# Altium schematic sheet Output Stages.SchDoc
size A3; SheetNumber: 4; SheetTotal: 5
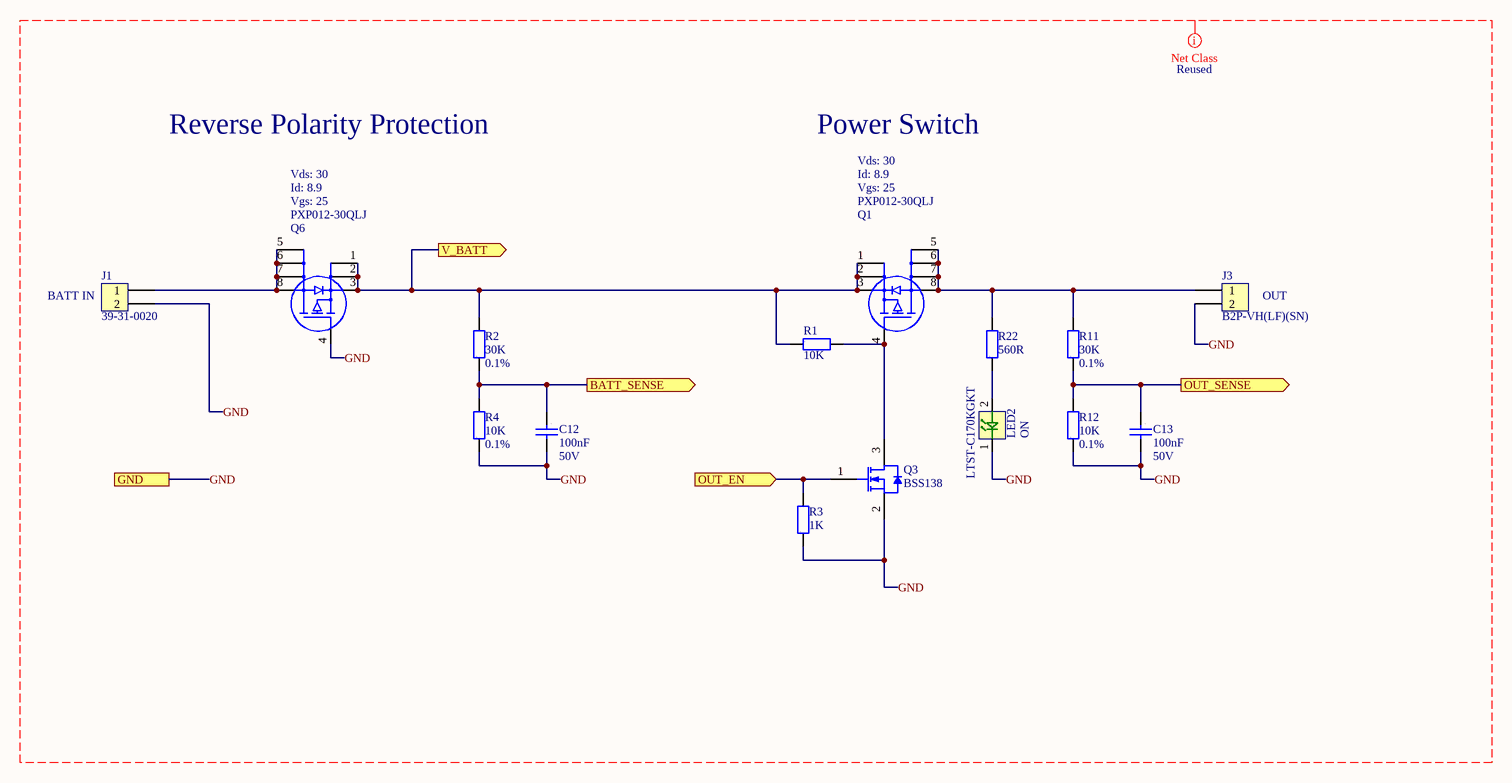
[diagram p0: Output Stages.SchDoc]

## Parts
C12  value 100nF  Voltage: 50V  [CAPC1608X08L]  (hidden comment: *)
C13  value 100nF  Voltage: 50V  [CAPC1608X08L]  (hidden comment: *)
J1  BATT IN  [39-31-0020]
J3  OUT  ManuPartNo: B2P-VH(LF)(SN)  [B2P-VH]
LED2  ON  ManuPartNo: LTST-C170KGKT  [CAPCP2012X11N]
Q1  Power Switch  ManuPartNo: PXP012-30QLJ  Vds: 30  Id: 8.9  Vgs: 25  [MLPAK33_SOT8002-1_NEX-M]
Q3  BSS138  [FAIR-SOT23-3_V]
Q6  Reverse Polarity Protection  ManuPartNo: PXP012-30QLJ  Vds: 30  Id: 8.9  Vgs: 25  [MLPAK33_SOT8002-1_NEX-M]
R1  value 10K  [RESC1608X06L]  (hidden comment: RESISTOR)
R2  value 30K  Tolerance: 0.1%  [RESC1608X06L]  (hidden comment: *)
R3  value 1K  [RESC1608X06L]  (hidden comment: RESISTOR)
R4  value 10K  Tolerance: 0.1%  [RESC1608X06L]  (hidden comment: *)
R11  value 30K  Tolerance: 0.1%  [RESC1608X06L]  (hidden comment: *)
R12  value 10K  Tolerance: 0.1%  [RESC1608X06L]  (hidden comment: *)
R22  value 560R  [RESC1608X06L]  (hidden comment: *)

## Ports
BATT_SENSE (out), GND, OUT_EN (in), OUT_SENSE (out), V_BATT (out)

## Nets
BATT_SENSE: C12.1 R2.1 R4.2 ; port BATT_SENSE
GND: C12.2 C13.2 J1.2 J3.2 LED2.1 Q3.2(S) Q6.4(Gate) R3.1 R4.1 R12.1 ; port GND
OUT_EN: Q3.1(G) R3.2 ; port OUT_EN
OUT_SENSE: C13.1 R11.1 R12.2 ; port OUT_SENSE
V_BATT: Q1.1(Source) Q1.2(Source) Q1.3(Source) Q6.1(Source) Q6.2(Source) Q6.3(Source) R1.1 R2.2 ; port V_BATT
NetJ1_1: J1.1 Q6.5(Drain) Q6.6(Drain) Q6.7(Drain) Q6.8(Drain)
NetJ3_1: J3.1 Q1.5(Drain) Q1.6(Drain) Q1.7(Drain) Q1.8(Drain) R11.2 R22.2
NetLED2_2: LED2.2 R22.1
NetQ1_4: Q1.4(Gate) Q3.3(D) R1.2

## Layout directives
net class Reused: GND

## Notes on the sheet
- ©
- CAD:
- Altium Designer
- Changed by:
- Drawing No:
- Change date:
- Title:
- Sub-Title:
- Project Sunride
  The Diamond
  32 Leavygreave Rd
  Broomhall, Sheffield
  United Kingdom
  S3 7RD
- THIS DRAWING REMAINS THE PROPERTY OF PROJECT SUNRIDE.
  COPYRIGHT FOR ALL PURPOSES IS VESTED IN PROJECT SUNRIDE.
  THE REPRODUCTION OF THIS DRAWING IN WHOLE OR IN PART IS PROHIBITED WITHOUT EXPRESS CONSENT IN WRITING. THIS DESIGN IS OFFERED FOR USE ONLY WITH EQUIPMENT MANUFACTURED OR SPECIFICALLY RECOMMENDED BY PROJECT SUNRIDE. RIGHTS ARE RESERVED TO MAKE A CHARGE FOR THE USE OF THIS DESIGN OR ANY PART THEREOF AND SUCH RIGHT SHALL SUBSIST UNLESS AND UNTIL THE SAME SHALL BE EXPRESSLY WAIVED IN WRITING. ACCEPTANCE OF THIS DRAWING WILL BE CONSTRUED AS AN ACCEPTANCE OF THESE CONDITIONS.
- Size:
- A3
- Change reason:
- Sheet
- of
- Variant:

## Library data of the parts
C12 C13 = FEC882-0023: Capacitor MLC 100nF 50V X7R 10% CAPC1608X08M; Manufacturer: Murata; ManuPartNo: GRM188R71H104KA93D; Cost 1+: 0.064; Cost 1K+: 0.039; Life: V; Source: FEC882-0023; Dielectric: X7R; Supplier 1: Farnell; Supplier Part Number 1: 8820023; Tolerance: 10%; Class: Capacitor MLC; RoHS: Y; Created: 25/01/2013; Last_Updated: 25/01/2013
J1 = FEC1756696: Connector 2 Way Mini-Fit 5566 Series; Manufacturer: Molex; Orient: Vertical; Cost 1+: 0.39; Cost 1K+: 0.283; Life: V; Source: FEC1756696; ManuPartNo: 39-31-0020; Pin Count: 2; Supplier 1: Farnell; Supplier Part Number 1: 1756696; Class: Connector; RoHS: Y; Created: 06/02/2018; Last_Updated: 06/02/2018; ComponentLink1Description: Datasheet; ComponentLink1URL: C:\Altium SANDBOX\Component Database\Datasheet\39-31-0020.pdf
J3 = FEC949-2003: Connector 2 Way Vertical JST B2P-VH(LF)(SN) 3.96mm Pitch; Cost 1+: 0.128; Cost 1K+: 0.074; Life: V; Source: FEC949-2003; Pin Count: 2; Orient#: Vertical; Manufacturer: JST; Supplier 1: Farnell; Supplier Part Number 1: 9492003; Pitch: 3.96mm; Class: Connector; RoHS: Y; Created: 13/06/2013; Last_Updated: 13/06/2013
LED2 = RS692-0907: LED 2.0x1.25mm GREEN 0805 LTST-C170KGKT; Manufacturer: Liteon; IF Max (mA): 80; IF Typ (mA): 30; View Angle: 130; Cost 1+: 0.169; Cost 1K+: 0.071; Class: LED 0805 Green; Life: V; Source: RS692-0907; RoHS: Y; Created: 05/08/2013; Last_Updated: 05/08/2013; ComponentLink1Description: Datasheet; ComponentLink1URL: C:\Altium SANDBOX\Component Database\Datasheet\LTST-C170KGKT.pdf; Supplier 1: RSComponents; Supplier Part Number 1: 692-0907
Q1 Q6 = FEC3934789: Power MOSFET, P Channel, 30 V, 15.2 A, 0.0111 ohm, MLPAK33, Surface Mount; Manufacturer: NEXPERIA; Rds(on): 0.0111; Pd (mW): 1700; Cost 1+: 0.598; Cost 1K+: 0.207; Class: Transistor MOSFET P; Source: FEC3934789; Supplier 1: Farnell; Supplier Part Number 1: 3934789; RoHS: Y; Life: V; Created: 24/09/2025; Last_Updated: 24/09/2025; ComponentLink1Description: Datasheet; ComponentLink1URL: C:\Altium SANDBOX\Component Database\Datasheet\3679934.pdf
Q3 = CMP-013-00021-3: N-Channel Logic Level Enhancement Mode Field Effect Transistor, 220 mA, 50 V, -55 to 150 degC, 3-Pin SOT-23, RoHS, Tape and Reel; Manufacturer: Fairchild; Resistance: 0.7Ohm; Rds On Max: 3.5Ohm; Typical Rise Time: 9ns; Power: 360mW; Elements: 1; Input Capacitance: 27pF; Package Version: Rev. 12, 03/2016; Nominal Vgs: 1.3V; Nominal Dual Supply Voltage: 50V; Pins: 3; Package Description: 3-Pin Small Outline Transistor, Body 2.92 x 1.325 mm, Pitch 0.95 mm; Datasheet Version: Rev. C, 10/2005; Mounting Technology: SM; Package Quantity: 1; Case/Package: TO-236-3; RoHS Compliant: True; Max Operating Temperature: 150°C; Package Reference: SOT23-3; Min Operating Temperature: -55°C; Datasheet URL: https://www.fairchildsemi.com/datasheets/BS/BSS138.pdf; Packaging: TapeandReel
R1 = PanasonicERA3AEB103V: SMD Chip Resistor, Thin Film, 10 kohm, 75 V, 0603 [1608 Metric], 100 mW, ± 0.1%, ERA3A Series; Voltage: 75V; Cost 1+: 0.237; Cost 1K+: 0.053; Power: 100mW; Source: PanasonicERA3AEB103V; Manufacturer: Panasonic; ManuPartNo: ERA3AEB103V; Supplier 1: Farnell; Supplier Part Number 1: 1577619; Tolerance: 0.1%; Class: Resistor; RoHS: Y; Life: V; Created: 27/02/2018; Last_Updated: 27/02/2018; ComponentLink1Description: Datasheet; ComponentLink1URL: C:\Altium SANDBOX\Component Database\Datasheet\Panasonic Resistors.pdf
R2 R11 = PanasonicERA3AEB303V: SMD Chip Resistor, Thin Film, 30 kohm, 75 V, 0603 [1608 Metric], 100 mW, ± 0.1%, ERA3A Series; Voltage: 75V; Power: 100mW; Cost 1+: 0.0538; Cost 1K+: 0.0349; Source: PanasonicERA3AEB303V; Manufacturer: Panasonic; ManuPartNo: ERA3AEB303V; Supplier 1: Farnell; Supplier Part Number 1: 1670196; Class: Resistor; RoHS: Y; Life: V; Created: 19/09/2025; Last_Updated: 19/09/2025; ComponentLink1Description: Datasheet; ComponentLink1URL: C:\Altium SANDBOX\Component Database\Datasheet\Panasonic Resistors.pdf
R3 = FEC2421849: SMD Chip Resistor, Thick Film, 1 kohm, 50 V, 0603 [1608 Metric], 100 mW, ± 1%, RC Series; Manufacturer: Yageo; ManuPartNo: RC0603FR-071KL; Voltage: 50V; Cost 1+: 0.002; Cost 1K+: 0.001; Power: 100mW; Source: FEC2421849; Supplier 1: Farnell; Supplier Part Number 1: 2421849; Tolerance: 1%; Class: Resistor; RoHS: Y; Life: V; Created: 22/05/2018; Last_Updated: 22/05/2018; ComponentLink1Description: Datasheet; ComponentLink1URL: C:\Altium SANDBOX\Component Database\Datasheet\Yageo RC_L Series.pdf
R4 R12 = PanasonicERA3AEB103V: SMD Chip Resistor, Thin Film, 10 kohm, 75 V, 0603 [1608 Metric], 100 mW, ± 0.1%, ERA3A Series; Voltage: 75V; Power: 100mW; Cost 1+: 0.237; Cost 1K+: 0.053; Source: PanasonicERA3AEB103V; Manufacturer: Panasonic; ManuPartNo: ERA3AEB103V; Supplier 1: Farnell; Supplier Part Number 1: 1577619; Class: Resistor; RoHS: Y; Life: V; Created: 27/02/2018; Last_Updated: 27/02/2018; ComponentLink1Description: Datasheet; ComponentLink1URL: C:\Altium SANDBOX\Component Database\Datasheet\Panasonic Resistors.pdf
R22 = FEC933-1344: Resistor 560R 1% 50V RESC1608X06M; Manufacturer: Multicomp; ManuPartNo: MC 0.063W 0603 1% 560R; Cost 1+: 0.021; Cost 1K+: 0.015; Life: V; Source: FEC933-1344; Voltage: 50V; Supplier 1: Farnell; Supplier Part Number 1: 9331344; Tolerance: 1%; Class: Resistor; RoHS: Y; Created: 23/01/2013; Last_Updated: 23/01/2013